# EAGLE design Schaltplan_VoltageLevelShifter_version3_RF_switch (EAGLE 7.6.0)
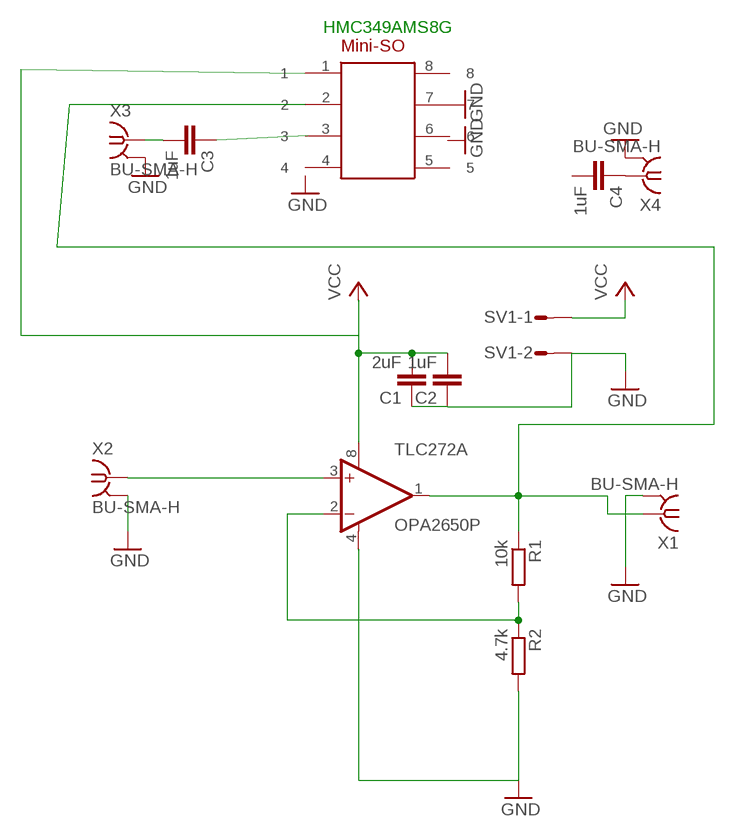
[diagram p0: schematic, sheet 1]

## Parts
C1  2uF  CYYC7B5  [YC7B5]
C2  1uF  CYYC7B5  [YC7B5]
C3  1uF  CYYC7B5  [YC7B5]
C4  1uF  CYYC7B5  [YC7B5]
HMC349AMS8G  MINI-SO  [MINI-SO]
R1  10k  R-EU_0207/12  [0207/12]
R2  4.7k  R-EU_0207/12  [0207/12]
SV1  S02P  [S02P]
TLC272  OPA2650P  [DIL08]
X1  BU-SMA-H  [BU-SMA-H]
X2  BU-SMA-H  [BU-SMA-H]
X3  BU-SMA-H  [BU-SMA-H]
X4  BU-SMA-H  [BU-SMA-H]

## Nets
GND: C1.1 C2.1 R2.2 SV1.2 TLC272.4(A:V-) X1.2 X1.3 X1.4 X1.5 X2.2 X2.3 X2.4 X2.5 X3.2 X3.3 X3.4 X3.5 X4.2 X4.3 X4.4 X4.5
N$1: R1.2 R2.1 TLC272.2(A:-IN)
N$2: C3.1
N$3: R1.1 TLC272.1(A:OUT) X1.1
N$4: C3.2 X3.1
N$5: C4.1 X4.1
N$6: TLC272.3(A:+IN) X2.1
VCC: C1.2 C2.2 SV1.1 TLC272.8(A:V+)
Unconnected: C4.2 HMC349AMS8G.1 HMC349AMS8G.2 HMC349AMS8G.3 HMC349AMS8G.4 HMC349AMS8G.5 HMC349AMS8G.6 HMC349AMS8G.7 HMC349AMS8G.8 TLC272.5(B:+IN) TLC272.6(B:-IN) TLC272.7(B:OUT)

## Notes on the sheet
- HMC349AMS8G

## Library data of the parts
C1-C4 = rcl:CY: Y CAPACITOR for power line
HMC349AMS8G = smd-special:MINI-SO: Mini-SO generic format
R1 R2 = rcl:R-EU_: RESISTOR, European symbol
SV1 = con-amp-mt:S02P: AMP MT CONNECTOR; OC_FARNELL: unknown; OC_NEWARK: unknown
TLC272 = burr-brown:OPA2650: Dual Wideband, Low Power Voltage Feedback Operational Amplifier; MPN: AD8056ANZ; OC_FARNELL: 1079308; OC_NEWARK: 19M0925
X1-X4 = con-coax:BU-SMA-H: FEMALE SMA CONNECTOR Radiall; OC_FARNELL: unknown; OC_NEWARK: unknown

## Board
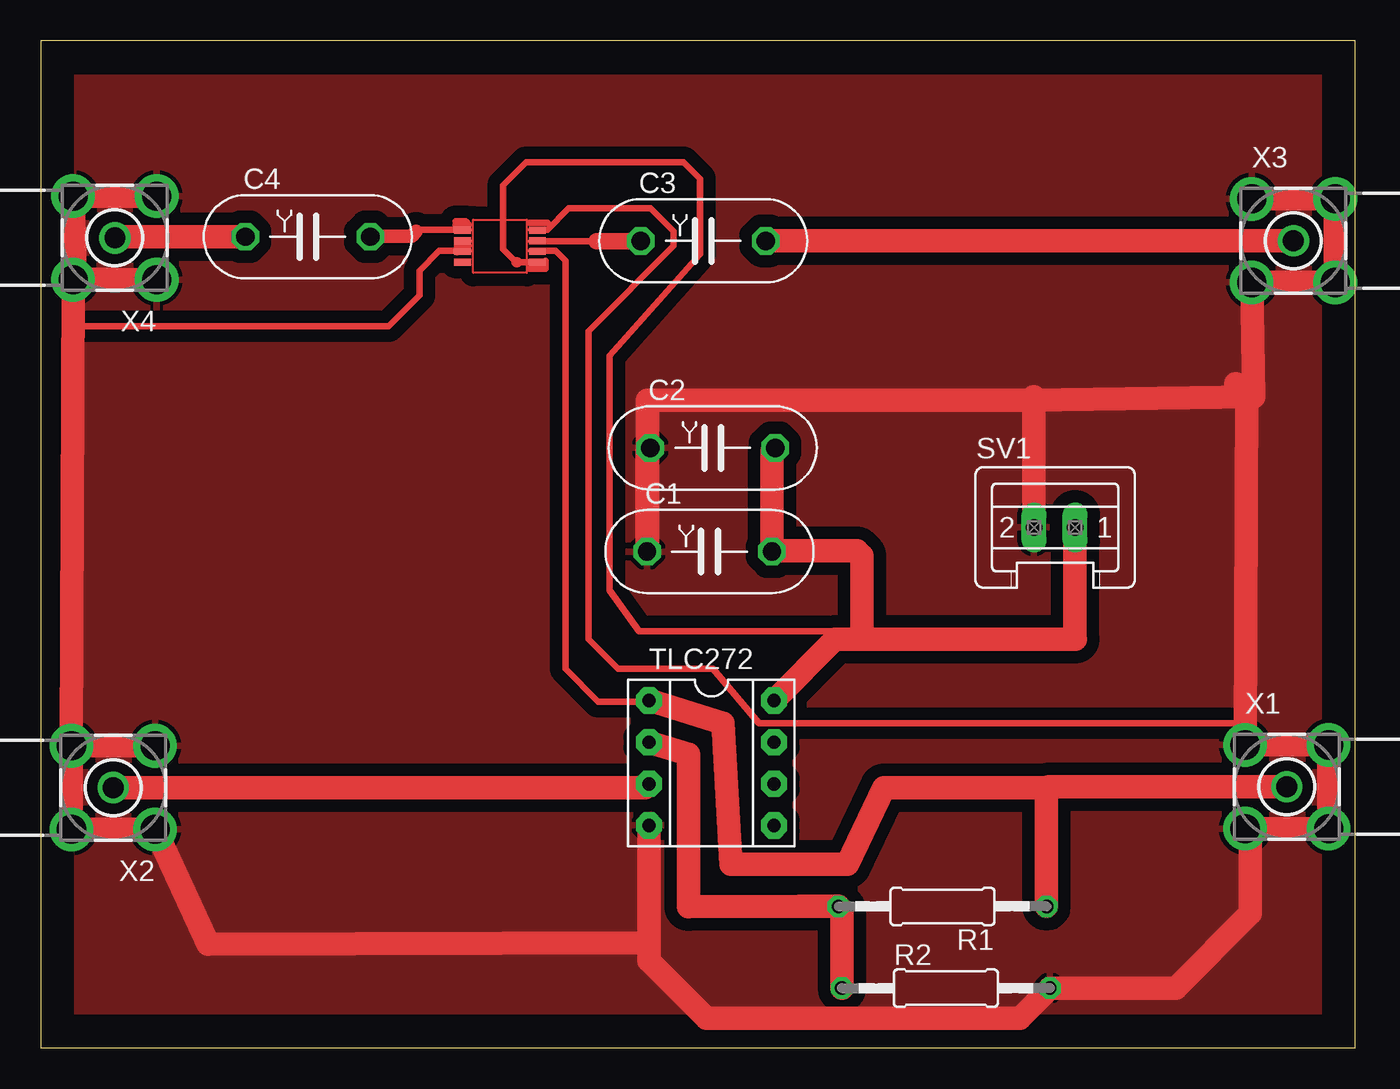
[diagram p1: board, top side]

Size 80.2 x 61.4 mm. Coordinates in mm from the lower left corner, seen from the top.
Outline: 0,0 80.2,0 80.2,61.4 0,61.4 0,0
Copper layers (1*16): Top 0.035mm / dielectric 1.5mm / Bottom 0.035mm
Design rules "default *": minimum track width 10mil, minimum drill 24mil, track to track 30mil, track to pad 8mil, pad to pad 8mil, via to via 8mil, smd to smd 8mil, copper to edge 80mil, drill to drill 8mil, minimum pad ring 10mil, minimum via ring 8mil, stop-mask expansion 4mil, vias tented up to drill 0mil, thermal gap 10mil

### Footprints (pad centres in the part's own frame; a part is rotated, then mirrored left to right if it is on the bottom)
YC7B5 = drill 1.118 octagon: 1 -3.81,0; 2 3.81,0
MINI-SO = smd 1.02 x 0.41: 1 0,0; 2 0,-0.65; 3 0,-1.3; 4 0,-1.95; 5 4.55,-1.95; 6 4.55,-1.3; 7 4.55,-0.65; 8 4.55,0
0207/12 = drill 0.813 octagon: 1 -6.35,0; 2 6.35,0
S02P = drill 1.016 long: 1 1.25,0; 2 -1.25,0
DIL08 = drill 0.813 pad 1.6 octagon: 1 -3.81,-3.81; 2 -1.27,-3.81; 3 1.27,-3.81; 4 3.81,-3.81; 5 3.81,3.81; 6 1.27,3.81; 7 -1.27,3.81; 8 -3.81,3.81
BU-SMA-H = drill 1.27: 1 0,0 | drill 1.778: 2 -2.55,2.55; 3 2.55,2.55; 4 2.55,-2.55; 5 -2.55,-2.55

### Placement (x,y rotation side)
C1  40.79,30.26 0 top
C2  40.99,36.58 0 top
C3  40.41,49.21 0 top
C4  16.28,49.46 0 top
HMC349AMS8G  30.28,47.91 180 top
R1  55.01,8.61 180 top
R2  55.21,3.63 0 top
SV1  61.84,31.73 0 top
TLC272  40.91,17.36 270 top
X1  76.02,15.91 0 top
X2  4.41,15.86 180 top
X3  76.42,49.22 0 top
X4  4.51,49.39 180 top

### Tracks (layer width: path | path; a pad name or v marks a point on that pad's centre or on a via)
GND
  Top 1.422: X2.5 X2.4 | X2.4 X2.3 X2.2 10.2,6.3 37.1,6.4 | TLC272.4 37.1,6.4 | 37.1,6.4 37.1,5.3 40.6,1.8 59.73,1.8 R2.2 69.23,3.63 73.8,8.2 73.8,13.03 X1.5 X1.4 X1.3 X1.2 73.57,40.23 72.9,40.5 74,39.7 | X4.5 X4.4 2.1,46.9 X4.2 X4.3 X2.4 | X3.2 X3.3 X3.4 X3.5 74,39.7 | 74,39.7 60.3,39.5 | 60.3,39.5 60.59,39.69 SV1.2 | C2.1 36.98,36.38 C1.1 37,30.28 37,39.5 60.3,39.5
  pour Top: 0.6,60.5 0.8,60.3 78.8,60.3 78.9,60.2 78.9,0.6 78.8,0.7 1.1,0.7 0.6,1.2
N$1
  Top 1.422: R2.1 48.86,8.41 R1.2 46.29,8.61 39.5,8.6 39.5,17.9 TLC272.2
N$3
  Top 1.422: R1.1 61.36,15.86 | 61.36,15.86 61.5,15.9 X1.1 | 61.36,15.86 51.44,15.86 49.2,11.2 42.1,11.2 41.6,19.8 37.13,21.2 TLC272.1
N$4
  Top 1.422: C3.2 X3.1
N$5
  Top 1.422: X4.1 4.58,49.46 C4.1
N$6
  Top 1.422: X2.1 36.87,15.86 TLC272.3
N$7
  Top 0.813: 20,49.5 22.6,49.5 22.9,49.8
N$8
  Top 0.406: 23.1,49.9 25.3,49.9 25.4,49.9 26.1,49.9
N$9
  Top 0.406: 25.4,48.6 25.4,49.2 26.1,49.2 | 25.4,48.6 25.4,48.5 | 25.4,48.6 25.3,48.6 24.3,48.6 23.1,47.4 23.1,45.9 21.2,44 2,44 | 25.4,48.6 26.1,48.6
N$10
  Top 0.406: 30.3,47.9 29,47.9 28.2,48.7 28.2,52.6 29.6,54 39.2,54 40.2,53 40.2,48.4 34.7,42.2 34.7,27.9 36.5,25.4 49.8,25.4
N$11
  Top 0.406: 33.9,49.2 33.5,49.2 30,49.2 29.9,49.2
  Top 1.016: 36.5,49.2 33.9,49.2
N$12
  Top 0.406: 29.9,49.9 30.9,49.9 32.2,51.2 37.2,51.2 38.6,49.8 38.6,48.9 33.4,43.7 33.4,24.9 35.2,23.1 41,23.1 43.8,19.8 73.2,19.8
N$13
  Top 0.406: 37.1,21.1 34,21.1 32,23.1 32,48 31.4,48.6 29.9,48.6
N$14
  Top 0.406: 25.3,50.2 26.1,50.2 25.9,50.4 25.3,50.4
N$15
  Top 0.406: 29.8,50.3 30.9,50.3
N$16
  Top 0.406: 29.8,47.5 30.7,47.5
N$17
  Top 0.406: 30.8,48 30.8,47.5
N$18
  Top 0.406: 25.6,49 25.7,48.9 26.1,48.9
VCC
  Top 1.422: TLC272.8 48.45,24.9 50.1,24.9 | 50.1,24.9 63.1,24.9 63.09,24.91 SV1.1 | 50.1,24.9 50.1,30 49.8,30.3 44.64,30.3 C1.2 44.6,36.38 C2.2